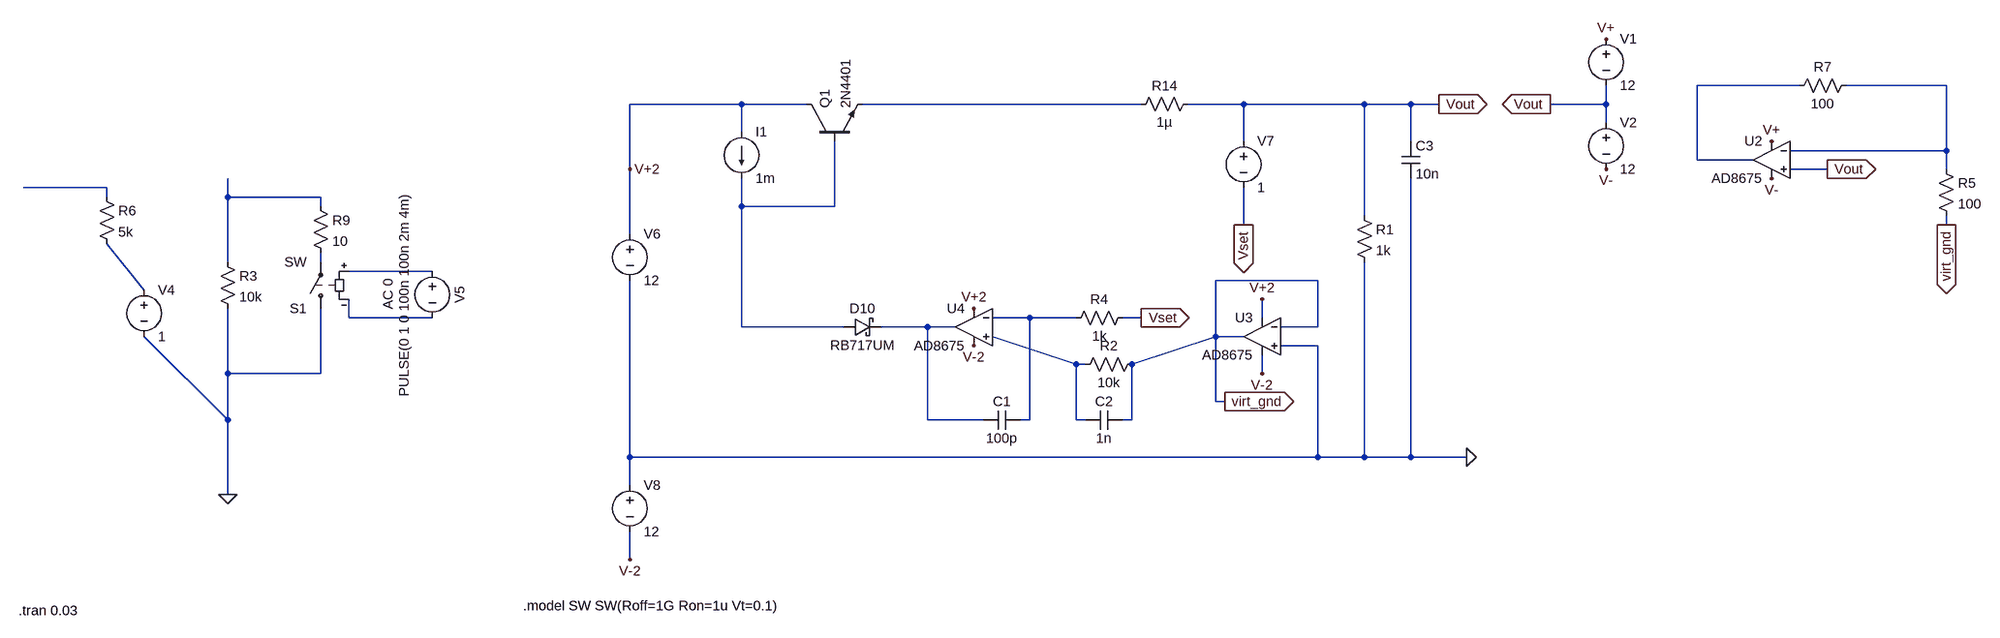
[diagram p0: schematic my_design_from_scratch_test_cv_cc_design_4_no_cc.asc]
my_design_from_scratch_test_cv_cc_design_4_no_cc.asc, the LTspice schematic file:
Version 4
SHEET 1 3784 1300
WIRE 3456 -16 3280 -16
WIRE 3712 -16 3536 -16
WIRE 1472 16 1280 16
WIRE 1584 16 1472 16
WIRE 2160 16 1680 16
WIRE 2336 16 2240 16
WIRE 2544 16 2336 16
WIRE 2624 16 2544 16
WIRE 2672 16 2624 16
WIRE 2960 16 2960 -16
WIRE 2960 16 2864 16
WIRE 2960 48 2960 16
WIRE 1472 64 1472 16
WIRE 2336 80 2336 16
WIRE 2624 80 2624 16
WIRE 3712 96 3712 -16
WIRE 3712 96 3440 96
WIRE 3280 112 3280 -16
WIRE 3376 112 3280 112
WIRE 1280 128 1280 16
WIRE 3504 128 3440 128
WIRE 3712 128 3712 96
WIRE -400 160 -544 160
WIRE -400 176 -400 160
WIRE -192 176 -192 144
WIRE -32 176 -192 176
WIRE -32 192 -32 176
WIRE 1472 192 1472 144
WIRE 1632 192 1632 80
WIRE 1632 192 1472 192
WIRE 2544 208 2544 16
WIRE 2336 224 2336 160
WIRE 3712 224 3712 208
WIRE 1280 240 1280 128
WIRE -192 288 -192 176
WIRE -32 288 -32 272
WIRE 160 304 16 304
WIRE 2464 320 2288 320
WIRE -336 336 -400 256
WIRE 16 384 16 352
WIRE 160 384 16 384
WIRE 1968 384 1904 384
WIRE 2048 384 1968 384
WIRE 2160 384 2128 384
WIRE 2368 384 2368 352
WIRE 1472 400 1472 192
WIRE 1648 400 1472 400
WIRE 1792 400 1712 400
WIRE 1840 400 1792 400
WIRE 2464 400 2464 320
WIRE 2464 400 2400 400
WIRE 2288 416 2288 320
WIRE 2336 416 2288 416
WIRE 2464 432 2400 432
WIRE 2048 464 1904 416
WIRE 2064 464 2048 464
WIRE 2144 464 2288 416
WIRE -192 480 -192 368
WIRE -32 480 -32 368
WIRE -32 480 -192 480
WIRE 2368 480 2368 448
WIRE 2288 528 2288 416
WIRE 2304 528 2288 528
WIRE -192 560 -336 416
WIRE -192 560 -192 480
WIRE 1792 560 1792 400
WIRE 1888 560 1792 560
WIRE 1968 560 1968 384
WIRE 1968 560 1952 560
WIRE 2048 560 2048 464
WIRE 2064 560 2048 560
WIRE 2144 560 2144 464
WIRE 2144 560 2128 560
WIRE 1280 624 1280 320
WIRE 2464 624 2464 432
WIRE 2464 624 1280 624
WIRE 2544 624 2544 288
WIRE 2544 624 2464 624
WIRE 2624 624 2624 144
WIRE 2624 624 2544 624
WIRE 2720 624 2624 624
WIRE 1280 672 1280 624
WIRE -192 688 -192 560
WIRE 1280 800 1280 752
FLAG 2336 224 Vset
IOPIN 2336 224 Out
FLAG 2160 384 Vset
IOPIN 2160 384 Out
FLAG -192 688 0
FLAG 1280 800 V-2
FLAG 1280 128 V+2
FLAG 1872 368 V+2
FLAG 1872 432 V-2
FLAG 2720 624 0
FLAG 2672 16 Vout
IOPIN 2672 16 Out
FLAG 2960 -96 V+
FLAG 2960 128 V-
FLAG 3408 80 V+
FLAG 3408 144 V-
FLAG 3504 128 Vout
IOPIN 3504 128 Out
FLAG 2368 352 V+2
FLAG 2368 480 V-2
FLAG 2304 528 virt_gnd
IOPIN 2304 528 Out
FLAG 3712 224 virt_gnd
IOPIN 3712 224 Out
FLAG 2864 16 Vout
IOPIN 2864 16 Out
SYMBOL voltage -336 320 R0
WINDOW 123 0 0 Left 0
WINDOW 39 0 0 Left 0
SYMATTR InstName V4
SYMATTR Value 1
SYMBOL res -208 272 R0
SYMATTR InstName R3
SYMATTR Value 10k
SYMBOL res -416 160 R0
SYMATTR InstName R6
SYMATTR Value 5k
SYMBOL sw -32 384 R180
SYMATTR InstName S1
SYMBOL voltage 160 288 R0
WINDOW 0 32 56 VTop 2
WINDOW 3 -32 56 VBottom 2
WINDOW 123 -60 56 VBottom 2
WINDOW 39 0 0 Left 0
SYMATTR InstName V5
SYMATTR Value PULSE(0 1 0 100n 100n 2m 4m)
SYMATTR Value2 AC 0
SYMBOL res -48 176 R0
SYMATTR InstName R9
SYMATTR Value 10
SYMBOL voltage 1280 224 R0
WINDOW 123 0 0 Left 0
WINDOW 39 0 0 Left 0
SYMATTR InstName V6
SYMATTR Value 12
SYMBOL voltage 2336 64 R0
WINDOW 123 0 0 Left 0
WINDOW 39 0 0 Left 0
SYMATTR InstName V7
SYMATTR Value 1
SYMBOL res 2144 32 R270
WINDOW 0 32 56 VTop 2
WINDOW 3 0 56 VBottom 2
SYMATTR InstName R14
SYMATTR Value 1µ
SYMBOL Opamps\\AD8675 1872 336 M0
SYMATTR InstName U4
SYMBOL schottky 1648 416 R270
WINDOW 0 32 32 VTop 2
WINDOW 3 0 32 VBottom 2
SYMATTR InstName D10
SYMATTR Value RB717UM
SYMATTR Description Diode
SYMATTR Type diode
SYMBOL res 2528 192 R0
SYMATTR InstName R1
SYMATTR Value 1k
SYMBOL npn 1584 80 R270
SYMATTR InstName Q1
SYMATTR Value 2N4401
SYMBOL current 1472 64 R0
WINDOW 123 0 0 Left 0
WINDOW 39 0 0 Left 0
SYMATTR InstName I1
SYMATTR Value 1m
SYMBOL res 2048 480 R270
WINDOW 0 32 56 VTop 2
WINDOW 3 0 56 VBottom 2
SYMATTR InstName R2
SYMATTR Value 10k
SYMBOL cap 1952 544 R90
WINDOW 0 0 32 VBottom 2
WINDOW 3 32 32 VTop 2
SYMATTR InstName C1
SYMATTR Value 100p
SYMBOL cap 2064 576 R270
WINDOW 0 32 32 VTop 2
WINDOW 3 0 32 VBottom 2
SYMATTR InstName C2
SYMATTR Value 1n
SYMBOL cap 2608 80 R0
SYMATTR InstName C3
SYMATTR Value 10n
SYMBOL res 2144 368 R90
WINDOW 0 0 56 VBottom 2
WINDOW 3 32 56 VTop 2
SYMATTR InstName R4
SYMATTR Value 1k
SYMBOL voltage 1280 656 R0
WINDOW 123 0 0 Left 0
WINDOW 39 0 0 Left 0
SYMATTR InstName V8
SYMATTR Value 12
SYMBOL voltage 2960 -112 R0
WINDOW 123 0 0 Left 0
WINDOW 39 0 0 Left 0
SYMATTR InstName V1
SYMATTR Value 12
SYMBOL voltage 2960 32 R0
WINDOW 123 0 0 Left 0
WINDOW 39 0 0 Left 0
SYMATTR InstName V2
SYMATTR Value 12
SYMBOL Opamps\\AD8675 3408 48 M0
SYMATTR InstName U2
SYMBOL res 3696 112 R0
SYMATTR InstName R5
SYMATTR Value 100
SYMBOL res 3552 -32 R90
WINDOW 0 0 56 VBottom 2
WINDOW 3 32 56 VTop 2
SYMATTR InstName R7
SYMATTR Value 100
SYMBOL Opamps\\AD8675 2368 352 M0
SYMATTR InstName U3
TEXT -552 888 Left 2 !.tran 0.03
TEXT 1096 880 Left 2 !.model SW SW(Roff=1G Ron=1u Vt=0.1)

The netlist it stands for:
* my_design_from_scratch_test_cv_cc_design_4_no_cc.asc
V4 N009 0 1
R3 N005 0 10k
R6 N004 N009 5k
S1 0 N007 N008 N010 SW
V5 N008 N010 PULSE(0 1 0 100n 100n 2m 4m) AC 0
R9 N005 N007 10
V6 V+2 0 12
V7 Vout Vset 1
R14 N003 Vout 1µ
XU4 N013 N011 V+2 V-2 N012 AD8675  ; pins In+ In- V+ V- OUT
D10 N006 N012 RB717UM
R1 Vout 0 1k
Q1 V+2 N006 N003 0 2N4401
I1 V+2 N006 1m
R2 N013 virt_gnd 10k
C1 N011 N012 100p
C2 N013 virt_gnd 1n
C3 Vout 0 10n
R4 Vset N011 1k
V8 0 V-2 12
V1 V+ Vout 12
V2 Vout V- 12
XU2 Vout N002 V+ V- N001 AD8675  ; pins In+ In- V+ V- OUT
R5 N002 virt_gnd 100
R7 N002 N001 100
XU3 0 virt_gnd V+2 V-2 virt_gnd AD8675  ; pins In+ In- V+ V- OUT
.model D D
.lib standard.dio
.model NPN NPN
.model PNP PNP
.lib standard.bjt
.tran 0.03
.model SW SW(Roff=1G Ron=1u Vt=0.1)
.backanno
.end